# EAGLE design DLC Breakout (EAGLE 7.7.0)
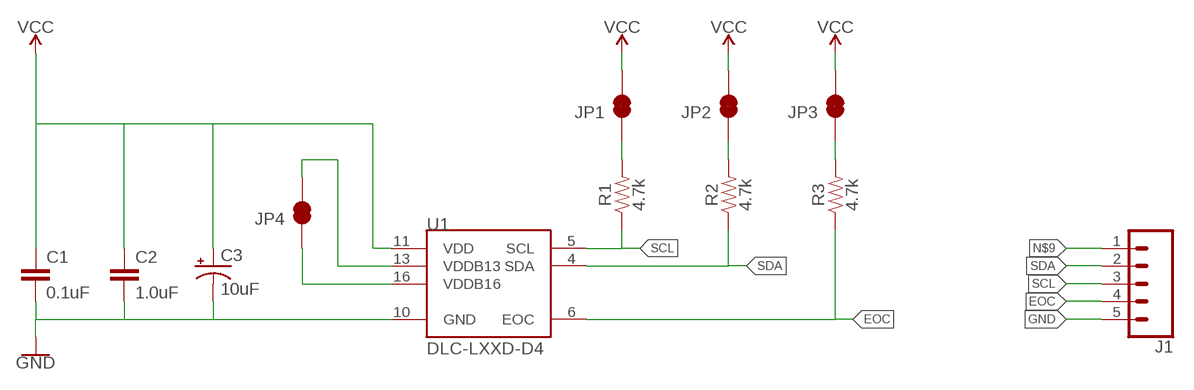
[diagram p0: schematic, sheet 1]

## Parts
C1  0.1uF  0.1UF-0603-25V-5%  [0603]
C2  1.0uF  1.0UF-0603-16V-10%  [0603]
C3  10uF  10UF-POLAR-EIA3216-16V-10%(TANT)  [EIA3216]
J1  CONN_05  [1X05]
JP1  JUMPER-SMT_2_NC_TRACE_NO-SILK  [SMT-JUMPER_2_NC_TRACE_NO-SILK]
JP2  JUMPER-SMT_2_NC_TRACE_NO-SILK  [SMT-JUMPER_2_NC_TRACE_NO-SILK]
JP3  JUMPER-SMT_2_NC_TRACE_NO-SILK  [SMT-JUMPER_2_NC_TRACE_NO-SILK]
JP4  JUMPER-SMT_2_NC_TRACE_NO-SILK  [SMT-JUMPER_2_NC_TRACE_NO-SILK]
R1  4.7k  4.7KOHM-0603-1/10W-1%  [0603]
R2  4.7k  4.7KOHM-0603-1/10W-1%  [0603]
R3  4.7k  4.7KOHM-0603-1/10W-1%  [0603]
U1  DLC-LXXD-D4  [DLC-LXXD-D4]

## Nets
EOC: J1.4 R3.1 U1.6(EOC)
GND: C1.2 C2.2 C3.- J1.5 U1.10(GND)
N$3: JP1.2 R1.2
N$4: JP2.2 R2.2
N$5: JP3.2 R3.2
N$9: C1.1 C2.1 C3.+ J1.1 JP1.1 JP2.1 JP3.1 U1.11(VDD) ; supply symbol labelled VCC
N$10: JP4.2 U1.16(VDDB16)
SCL: J1.3 R1.1 U1.5(SCL)
SDA: J1.2 R2.1 U1.4(SDA)
VDDB: JP4.1 U1.13(VDDB13)

## Library data of the parts
C1 = SparkFun-Capacitors:0.1UF: 0.1µF ceramic capacitors A capacitor is a passive two-terminal electrical component used to store electrical energy temporarily in an electric field.; PROD_ID: CAP-08604
C2 = SparkFun-Capacitors:1.0UF: 1µF ceramic capacitors A capacitor is a passive two-terminal electrical component used to store electrical energy temporarily in an electric field.; PROD_ID: CAP-00868
C3 = SparkFun-Capacitors:10UF-POLAR: 10.0µF polarized capacitors A capacitor is a passive two-terminal electrical component used to store electrical energy temporarily in an electric field.; PROD_ID: CAP-00811
J1 = SparkFun-Connectors:CONN_05: Multi connection point. Often used as Generic Header-pin footprint for 0.1 inch spaced/style header connections On any of the 0.1 inch spaced packages, you can populate with these: Break Away Headers - Straight <https://www.sparkfun.com/products/116> (PRT-00116) Break Away Male Headers - Right Angle <https://www.sparkfun.com/products/553> (PRT-00553) Female Headers <https://www.sparkfun.com/products/115> (PRT-00115) Break Away Headers - Machine Pin <https://www.sparkfun.com/products/117> (PRT-00117) Break Away Female Headers - Swiss Machine Pin <https://www.sparkfun.com/products/743> (PRT-00743) For SCREWTERMINALS and SPRING TERMINALS visit here: Screw Terimnals on SparkFun.com <https://www.sparkfun.com/search/results?term=Screw+Terminals> (5mm/3.5mm/2.54mm spacing) This device is also useful as a general connection point to wire up your design to another part of your project. Our various solder wires solder well into these plated through hole pads. Hook-Up Wire - Assortment (Stranded, 22 AWG) <https://www.sparkfun.com/products/11375> (PRT-11375) Hook-Up Wire - Assortment (Solid Core, 22 AWG) <https://www.sparkfun.com/products/11367> (PRT-11367) View the entire wire category on our website here <https://www.sparkfun.com/categories/141> Special notes: Molex polarized connector foot print use with SKU : PRT-08231 with associated crimp pins and housings. 1MM SMD Version SKU: PRT-10208
JP1-JP4 = SparkFun-Jumpers:JUMPER-SMT_2_NC_TRACE: Normally closed trace jumper This jumper has a trace between two pads so it's normally closed (NC). Use a razor knife to open the connection. For best results follow the IPC guidelines for cutting traces: Cutout at least 0.063 mm (0.005 in). Remove all loose material to clean up the cut area. Seal the cut with an approved epoxy. Reapply solder to reclose the connection.
R1-R3 = SparkFun-Resistors:4.7KOHM: 4.7kΩ resistor A resistor is a passive two-terminal electrical component that implements electrical resistance as a circuit element. Resistors act to reduce current flow, and, at the same time, act to lower voltage levels within circuits. - Wikipedia; PROD_ID: RES-07857
U1 = SparkFun-Sensors:DLC-LXXD-D4

## Board
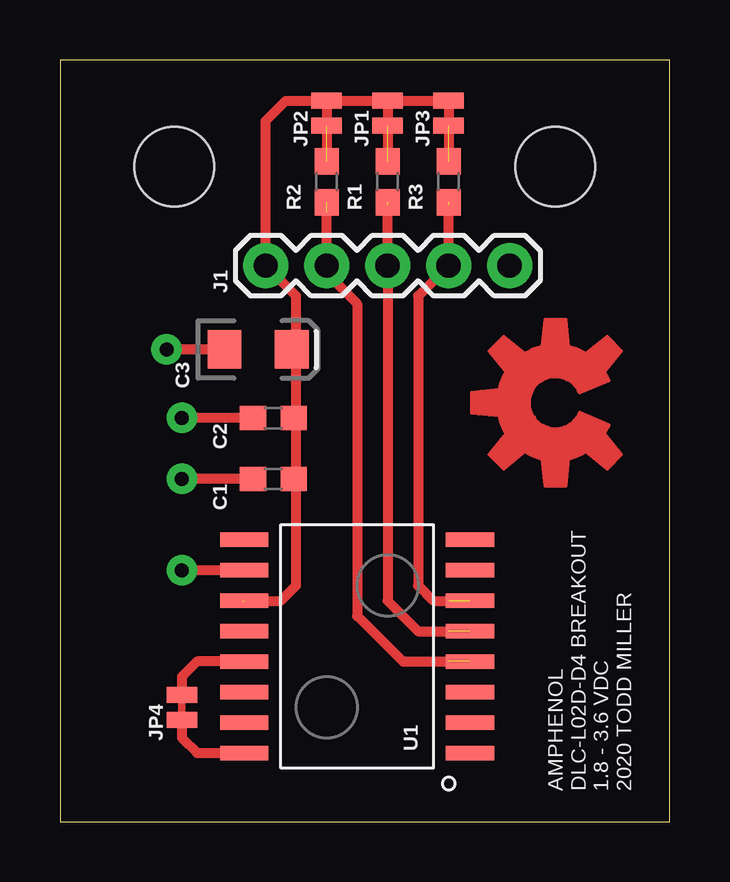
[diagram p1: board, top side]
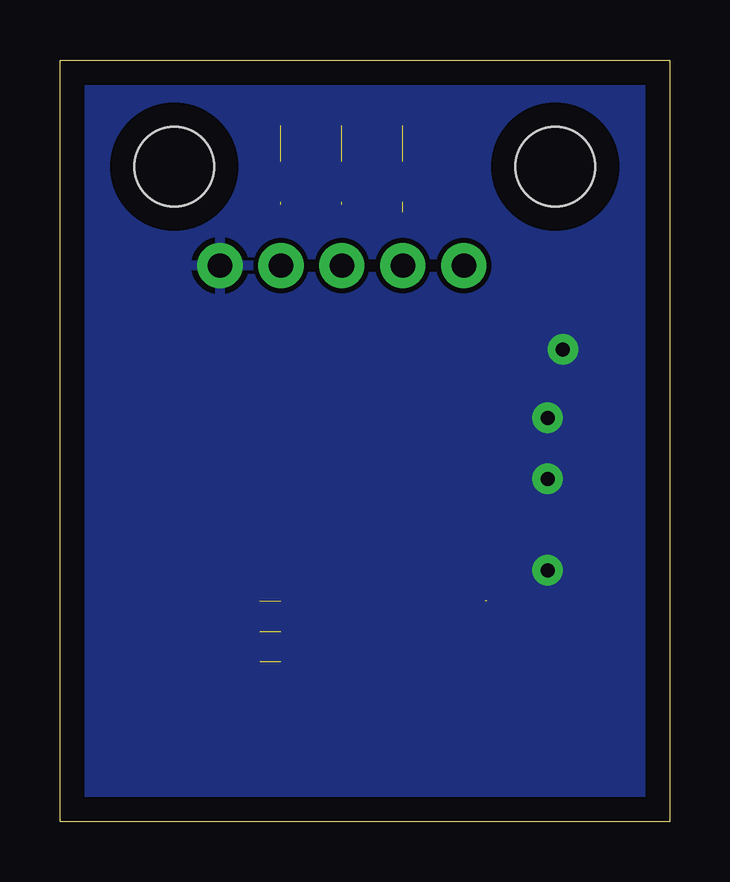
[diagram p2: board, bottom side, seen from below]

Size 25.4 x 31.75 mm. Coordinates in mm from the lower left corner, seen from the top.
Outline: 0,0 25.4,0 25.4,31.75 0,31.75 0,0
Copper layers (1*16): Top 0.035mm / dielectric 1.5mm / Bottom 0.035mm
Design rules "default": minimum track width 10mil, minimum drill 24mil, track to track 8mil, track to pad 8mil, pad to pad 8mil, via to via 8mil, smd to smd 8mil, copper to edge 40mil, drill to drill 8mil, minimum pad ring 10mil, minimum via ring 8mil, stop-mask expansion 4mil, vias tented up to drill 0mil, thermal gap 10mil
tRestrict: 4 lines
bRestrict: 4 lines

### Footprints (pad centres in the part's own frame; a part is rotated, then mirrored left to right if it is on the bottom)
0603 = smd 1.1 x 1: 1 -0.85,0; 2 0.85,0
EIA3216 = smd 1.4 x 1.6: + 1.4,0; - -1.4,0
1X05 = drill 1.016 pad 1.88: 1 0,0; 2 2.54,0; 3 5.08,0; 4 7.62,0; 5 10.16,0
SMT-JUMPER_2_NC_TRACE_NO-SILK = smd 0.66 x 1.27: 1 -0.521,0; 2 0.521,0
DLC-LXXD-D4 = smd 0.61 x 2.007: 1 4.445,4.699; 2 3.175,4.699; 3 1.905,4.699; 4 0.635,4.699; 5 -0.635,4.699; 6 -1.905,4.699; 7 -3.175,4.699; 8 -4.445,4.699; 9 -4.445,-4.699; 10 -3.175,-4.699; 11 -1.905,-4.699; 12 -0.635,-4.699; 13 0.635,-4.699; 14 1.905,-4.699; 15 3.175,-4.699; 16 4.445,-4.699
STAND-OFF = hole 3.302: 0,0

### Placement (x,y rotation side)
C1  8.89,14.29 180 top
C2  8.89,16.83 180 top
C3  8.26,19.68 0 top
J1  8.57,23.18 0 top
JP1  13.65,29.53 270 top
JP2  11.11,29.53 270 top
JP3  16.19,29.53 270 top
JP4  5.08,4.76 270 top
R1  13.65,26.67 90 top
R2  11.11,26.67 90 top
R3  16.19,26.67 90 top
U1  12.38,7.3 270 top
U$1  [STAND-OFF]  4.76,27.3 0 top
U$2  [STAND-OFF]  20.64,27.3 0 top
U$3  [OSHW-LOGO-L_COPPER]  20.64,17.46 90 top

### Tracks (layer width: path | path; a pad name or v marks a point on that pad's centre or on a via)
EOC  (2 unrouted)
  Top 0.406: 16.19,9.21 15.56,9.21 14.92,9.84 14.92,21.91 J1.4 16.19,25.72
GND  (via drill 0.58 pad 1.27)
  Top 0.406: C1.2 v5.08,14.29 | U1.10 v5.08,10.48 | C3.- v4.45,19.68 | C2.2 v5.08,16.83
  pour Bottom: 0,0 0,31.75 25.4,31.75 25.4,0
N$1
  Top 0.406: 11.11,29.84 11.11,27.94
N$2
  Top 0.406: 13.65,29.84 13.65,27.94
N$3  (1 unrouted)
N$4  (1 unrouted)
N$5  (1 unrouted)
N$6
  Top 0.406: 16.19,29.84 16.19,27.94
N$9  (1 unrouted)
  Top 0.406: 7.62,9.21 9.21,9.21 9.84,9.84 9.84,14.29 | 9.84,14.29 9.84,16.83 | 9.84,16.83 9.84,19.68 | 9.84,19.68 9.84,21.91 J1.1 8.57,29.21 9.41,30.05 JP2.1 JP1.1 JP3.1 | C1.1 9.84,14.29 | C2.1 9.84,16.83 | C3.+ 9.84,19.68
N$10
  Top 0.406: JP4.2 5.08,3.49 5.71,2.86 U1.16
SCL  (2 unrouted)
  Top 0.406: 16.19,7.94 14.92,7.94 13.65,9.21 J1.3 13.65,25.72
SDA  (2 unrouted)
  Top 0.406: 16.19,6.67 14.29,6.67 12.38,8.57 12.38,21.59 11.11,22.86 J1.2 11.11,25.4
VDDB
  Top 0.406: U1.13 5.71,6.67 5.08,6.03 JP4.1

### Text on the board
tNames: AMPHENOL / DLC-L02D-D4 BREAKOUT / 1.8 - 3.6 VDC / 2020 TODD MILLER